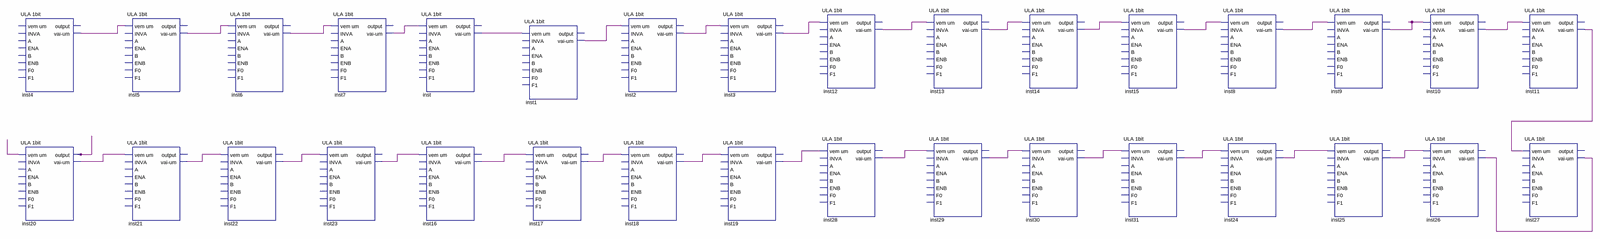
[diagram p0: schematic sheet, whole]
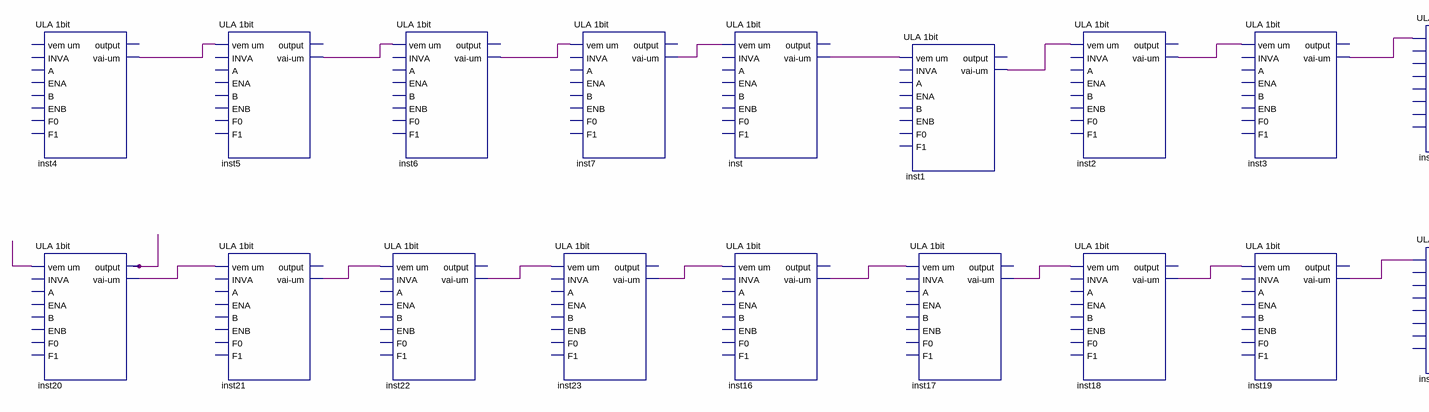
[diagram p1: schematic sheet, left part]
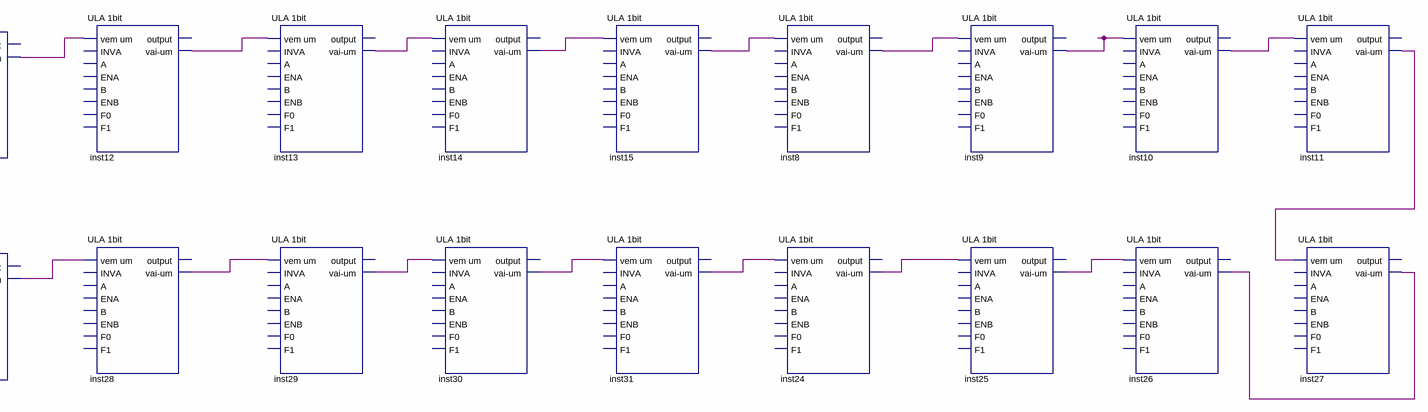
[diagram p2: schematic sheet, right part]
// Quartus schematic ULA 32bit.bdf as structural Verilog: 32 symbols, 0 pins
module \ULA_32bit  (
);

  wire inst1_vai_um, inst2_vai_um, inst3_vai_um, inst4_vai_um, inst5_vai_um, inst6_vai_um, inst7_vai_um,
       inst8_vai_um, inst9_vai_um, inst10_vai_um, inst11_vai_um, inst12_vai_um, inst13_vai_um, inst14_vai_um,
       inst15_vai_um, inst16_vai_um, inst17_vai_um, inst18_vai_um, inst19_vai_um, inst20_output,
       inst20_vai_um, inst21_vai_um, inst22_vai_um, inst23_vai_um, inst24_vai_um, inst25_vai_um,
       inst26_vai_um, inst28_vai_um, inst29_vai_um, inst30_vai_um, inst31_vai_um, inst_vai_um, undriven;

  \ULA_1bit  inst4 (.\vai-um (inst4_vai_um));  // open: vem um, INVA, A, ENA, B, ENB, F0, F1, output
  \ULA_1bit  inst20 (
    .\vem_um (undriven), .\output (inst20_output), .\vai-um (inst20_vai_um));  // open: INVA, A, ENA, B, ENB, F0, F1
  \ULA_1bit  inst5 (.\vem_um (inst4_vai_um), .\vai-um (inst5_vai_um));  // open: INVA, A, ENA, B, ENB, F0, F1, output
  \ULA_1bit  inst21 (.\vem_um (inst20_vai_um), .\vai-um (inst21_vai_um));  // open: INVA, A, ENA, B, ENB, F0, F1, output
  \ULA_1bit  inst22 (.\vem_um (inst21_vai_um), .\vai-um (inst22_vai_um));  // open: INVA, A, ENA, B, ENB, F0, F1, output
  \ULA_1bit  inst6 (.\vem_um (inst5_vai_um), .\vai-um (inst6_vai_um));  // open: INVA, A, ENA, B, ENB, F0, F1, output
  \ULA_1bit  inst7 (.\vem_um (inst6_vai_um), .\vai-um (inst7_vai_um));  // open: INVA, A, ENA, B, ENB, F0, F1, output
  \ULA_1bit  inst23 (.\vem_um (inst22_vai_um), .\vai-um (inst23_vai_um));  // open: INVA, A, ENA, B, ENB, F0, F1, output
  \ULA_1bit  inst (.\vem_um (inst7_vai_um), .\vai-um (inst_vai_um));  // open: INVA, A, ENA, B, ENB, F0, F1, output
  \ULA_1bit  inst16 (.\vem_um (inst23_vai_um), .\vai-um (inst16_vai_um));  // open: INVA, A, ENA, B, ENB, F0, F1, output
  \ULA_1bit  inst1 (.\vem_um (inst_vai_um), .\vai-um (inst1_vai_um));  // open: INVA, A, ENA, B, ENB, F0, F1, output
  \ULA_1bit  inst17 (.\vem_um (inst16_vai_um), .\vai-um (inst17_vai_um));  // open: INVA, A, ENA, B, ENB, F0, F1, output
  \ULA_1bit  inst2 (.\vem_um (inst1_vai_um), .\vai-um (inst2_vai_um));  // open: INVA, A, ENA, B, ENB, F0, F1, output
  \ULA_1bit  inst18 (.\vem_um (inst17_vai_um), .\vai-um (inst18_vai_um));  // open: INVA, A, ENA, B, ENB, F0, F1, output
  \ULA_1bit  inst3 (.\vem_um (inst2_vai_um), .\vai-um (inst3_vai_um));  // open: INVA, A, ENA, B, ENB, F0, F1, output
  \ULA_1bit  inst19 (.\vem_um (inst18_vai_um), .\vai-um (inst19_vai_um));  // open: INVA, A, ENA, B, ENB, F0, F1, output
  \ULA_1bit  inst12 (.\vem_um (inst3_vai_um), .\vai-um (inst12_vai_um));  // open: INVA, A, ENA, B, ENB, F0, F1, output
  \ULA_1bit  inst28 (.\vem_um (inst19_vai_um), .\vai-um (inst28_vai_um));  // open: INVA, A, ENA, B, ENB, F0, F1, output
  \ULA_1bit  inst13 (.\vem_um (inst12_vai_um), .\vai-um (inst13_vai_um));  // open: INVA, A, ENA, B, ENB, F0, F1, output
  \ULA_1bit  inst29 (.\vem_um (inst28_vai_um), .\vai-um (inst29_vai_um));  // open: INVA, A, ENA, B, ENB, F0, F1, output
  \ULA_1bit  inst14 (.\vem_um (inst13_vai_um), .\vai-um (inst14_vai_um));  // open: INVA, A, ENA, B, ENB, F0, F1, output
  \ULA_1bit  inst30 (.\vem_um (inst29_vai_um), .\vai-um (inst30_vai_um));  // open: INVA, A, ENA, B, ENB, F0, F1, output
  \ULA_1bit  inst15 (.\vem_um (inst14_vai_um), .\vai-um (inst15_vai_um));  // open: INVA, A, ENA, B, ENB, F0, F1, output
  \ULA_1bit  inst31 (.\vem_um (inst30_vai_um), .\vai-um (inst31_vai_um));  // open: INVA, A, ENA, B, ENB, F0, F1, output
  \ULA_1bit  inst8 (.\vem_um (inst15_vai_um), .\vai-um (inst8_vai_um));  // open: INVA, A, ENA, B, ENB, F0, F1, output
  \ULA_1bit  inst24 (.\vem_um (inst31_vai_um), .\vai-um (inst24_vai_um));  // open: INVA, A, ENA, B, ENB, F0, F1, output
  \ULA_1bit  inst9 (.\vem_um (inst8_vai_um), .\vai-um (inst9_vai_um));  // open: INVA, A, ENA, B, ENB, F0, F1, output
  \ULA_1bit  inst25 (.\vem_um (inst24_vai_um), .\vai-um (inst25_vai_um));  // open: INVA, A, ENA, B, ENB, F0, F1, output
  \ULA_1bit  inst10 (.\vem_um (inst9_vai_um), .\vai-um (inst10_vai_um));  // open: INVA, A, ENA, B, ENB, F0, F1, output
  \ULA_1bit  inst26 (.\vem_um (inst25_vai_um), .\vai-um (inst26_vai_um));  // open: INVA, A, ENA, B, ENB, F0, F1, output
  \ULA_1bit  inst11 (.\vem_um (inst10_vai_um), .\vai-um (inst11_vai_um));  // open: INVA, A, ENA, B, ENB, F0, F1, output
  \ULA_1bit  inst27 (.\vem_um (inst11_vai_um), .\vai-um (inst26_vai_um));  // open: INVA, A, ENA, B, ENB, F0, F1, output
endmodule
